# EasyEDA Pro project ProProject_Microplate-Reader-V1.0_2024-02-11.epro

# Schematic Schematic1
Create Date: 2024-02-05; Page Name: P1; Project Name: Microplate-Reader-V1.0; Schematic Name: Schematic2; Update Date: 2024-02-06; Company: EasyEDA.com; Drawn: EasyEDA; Page Size: A4; Part Number: JLCPCB-002; Reviewed: EasyEDA; Version: V0.1
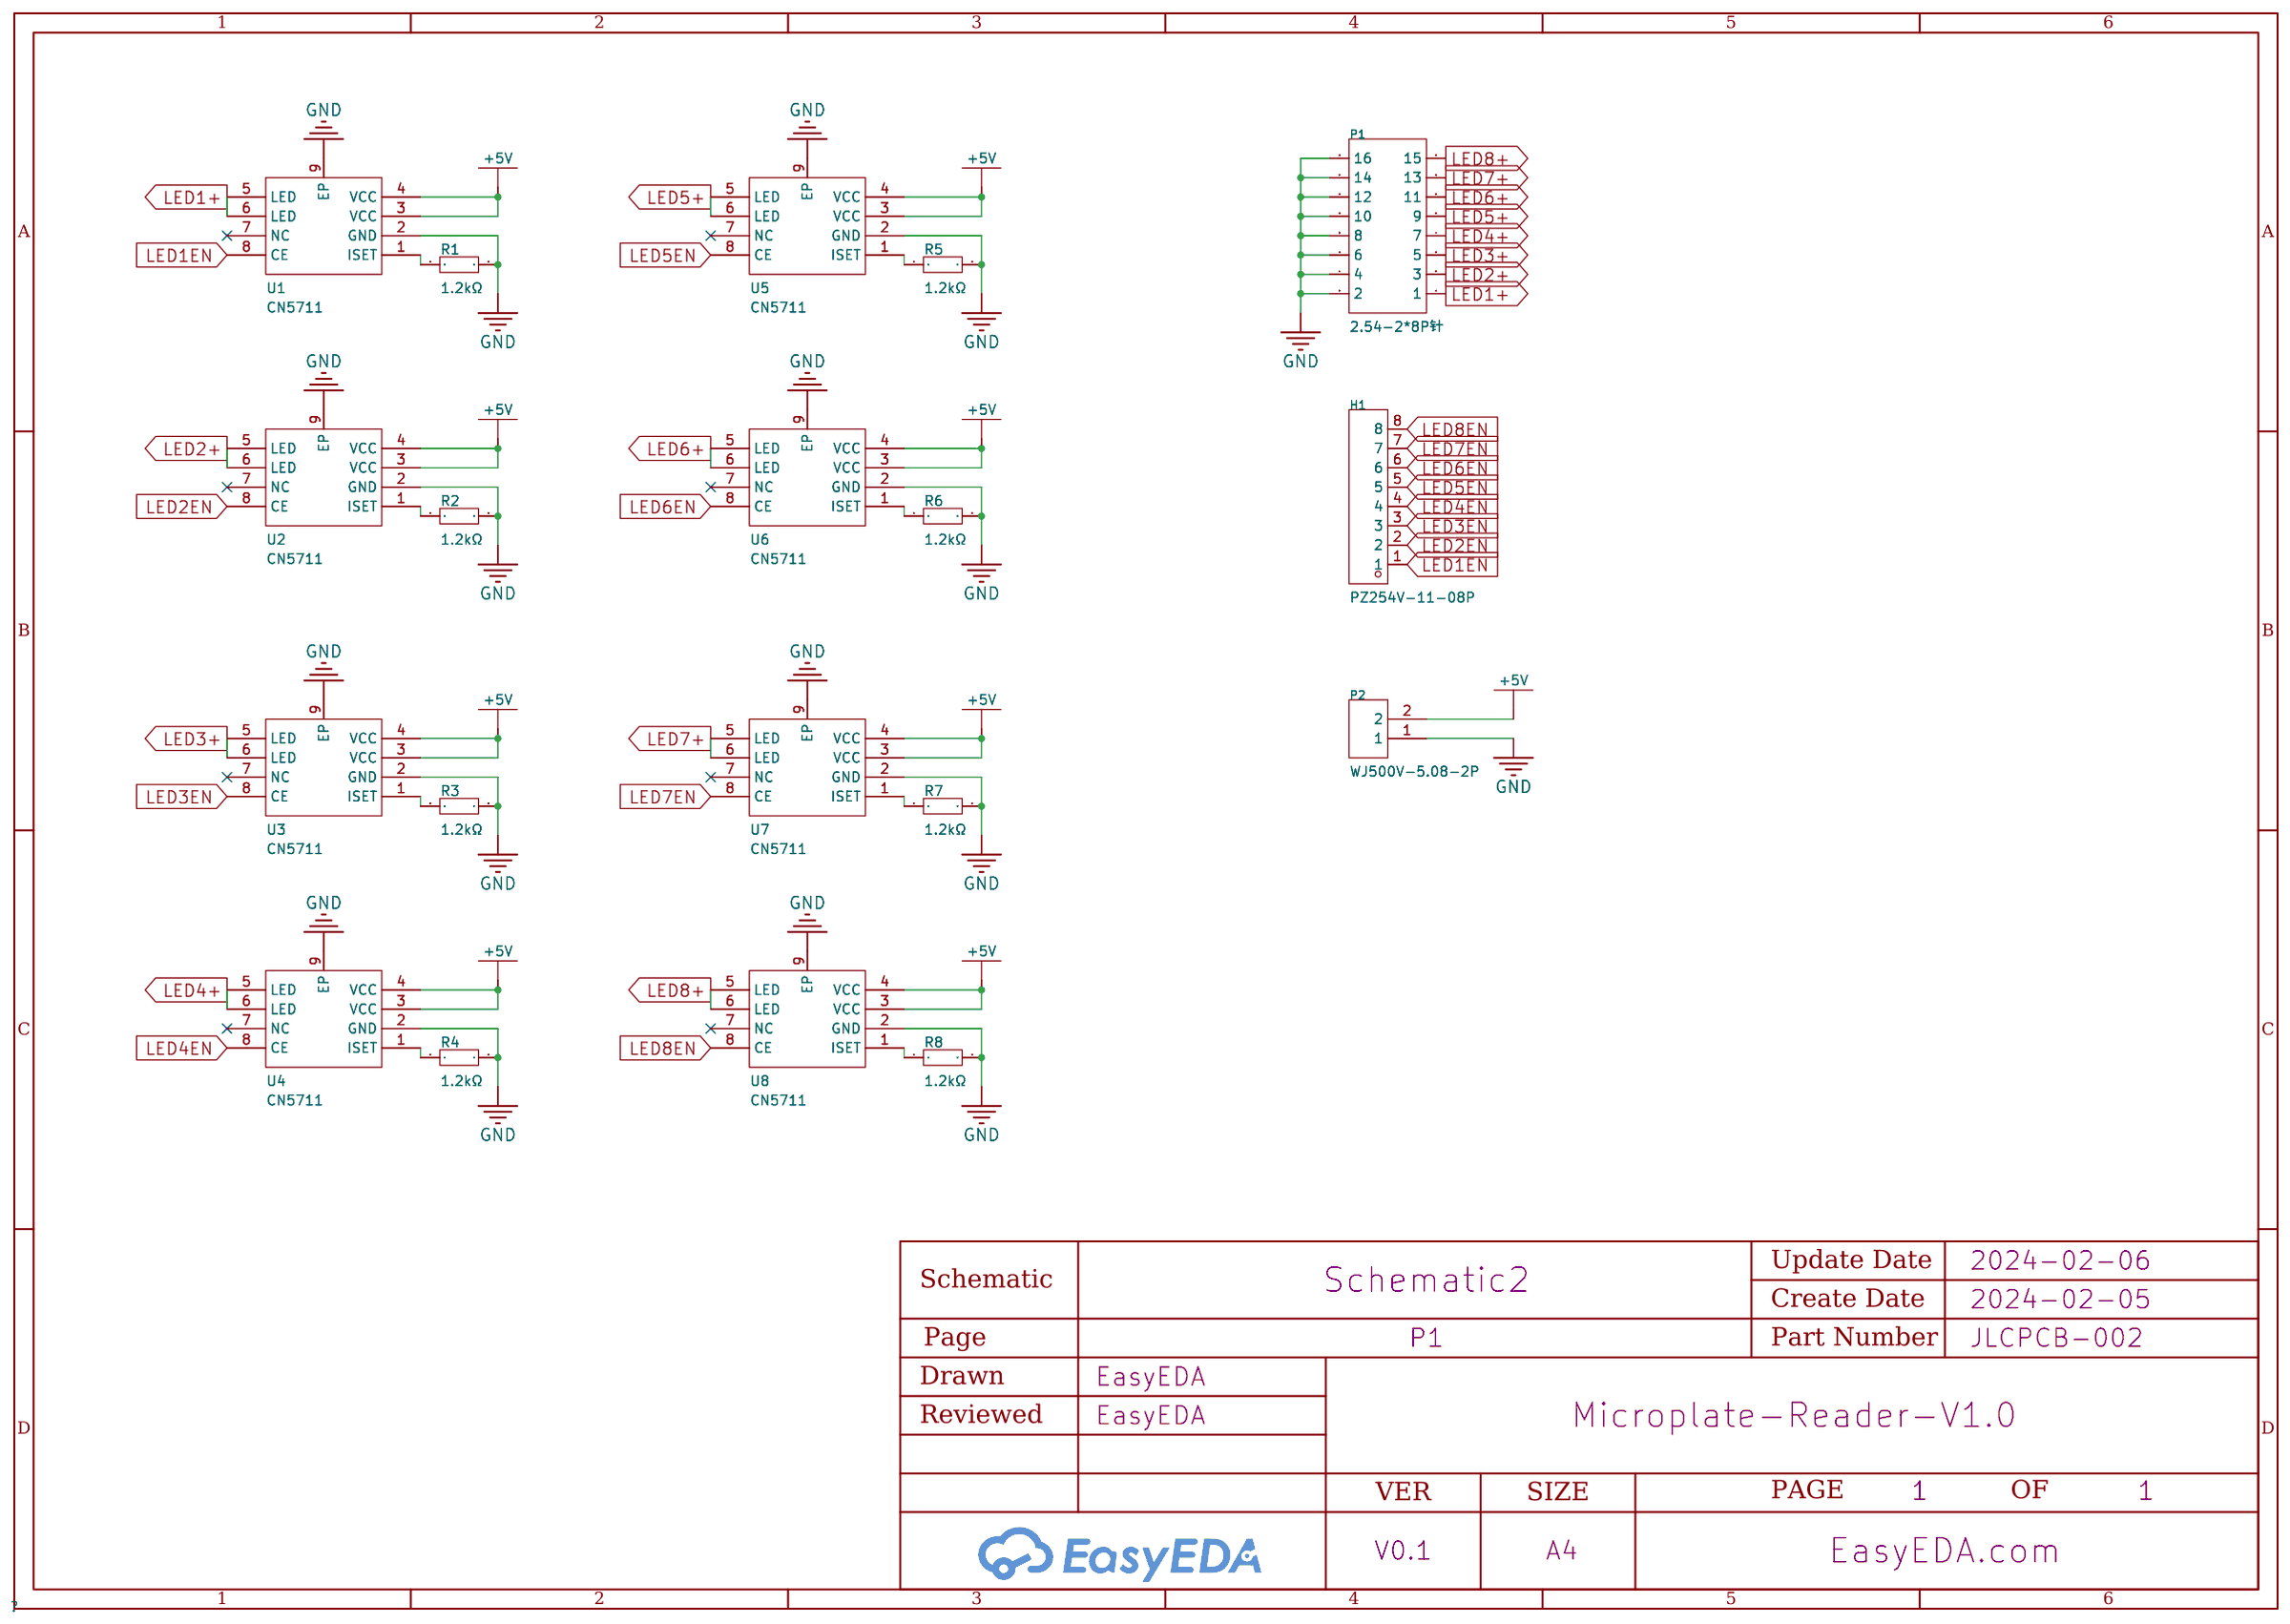
[diagram p0: schematic sheet]

## Parts
H1  PZ254V-11-08P  [HDR-TH_8P-P2.54-V-M]
P1  2.54-2*8P针  [HDR-TH_16P-P2.54-V-M-R2-C8-S2.54]
P2  WJ500V-5.08-2P  [CONN-TH_2P-P5.00_WJ500V-5.08-2P]
R1  1.2kΩ  [R0603]
R2  1.2kΩ  [R0603]
R3  1.2kΩ  [R0603]
R4  1.2kΩ  [R0603]
R5  1.2kΩ  [R0603]
R6  1.2kΩ  [R0603]
R7  1.2kΩ  [R0603]
R8  1.2kΩ  [R0603]
U1  CN5711  [SOIC-8_L5.0-W4.0-P1.27-LS6.0-BL-EP2.0]
U2  CN5711  [SOIC-8_L5.0-W4.0-P1.27-LS6.0-BL-EP2.0]
U3  CN5711  [SOIC-8_L5.0-W4.0-P1.27-LS6.0-BL-EP2.0]
U4  CN5711  [SOIC-8_L5.0-W4.0-P1.27-LS6.0-BL-EP2.0]
U5  CN5711  [SOIC-8_L5.0-W4.0-P1.27-LS6.0-BL-EP2.0]
U6  CN5711  [SOIC-8_L5.0-W4.0-P1.27-LS6.0-BL-EP2.0]
U7  CN5711  [SOIC-8_L5.0-W4.0-P1.27-LS6.0-BL-EP2.0]
U8  CN5711  [SOIC-8_L5.0-W4.0-P1.27-LS6.0-BL-EP2.0]

## Library data of the parts
H1 = PZ254V-11-08P: Pin Structure:1x8P Pitch:2.54mm Row Spacing:- Circluar Pins/Square Pins:Square Pins Mounting Type:Straight Number of Rows:Plugin Number of Pins:8P Current Rating (Max):- Voltage Rating (Max):- Length of Mating Pin:6mm Insulation Height:2.5mm Length of End; LCSC Part Name: 间距:2.54mm 1x8P 直插 方针; Supplier Part: C492407; Manufacturer: XFCN(兴飞); Supplier Footprint: 插件,P=2.54mm; JLCPCB Part Class: 扩展库; Datasheet: https://atta.szlcsc.com/upload/public/pdf/source/20200309/C492407_83A6FB26A2233368EDB9516968EC6149.pdf; Supplier: LCSC; Pin Structure: 1x8P; Pitch: 2.54mm; Circluar Pins/Square Pins: Square Pins; Mounting Type: Straight; Number of Rows: Plugin; Number of Pins: 8P; Length of Mating Pin: 6mm; Insulation Height: 2.5mm; Length of End Connection Pin: 3mm; Operating Temperature Range: -40℃~+105℃; Color: Black
P1 = 2.54-2*8P针_C68234: Pin Structure:2x8P Pitch:2.54mm Row Spacing:2.54mm Circluar Pins/Square Pins:Square Pins Mounting Type:Straight Number of Rows:双排 Number of Pins:16P Current Rating (Max):- Voltage Rating (Max):- Length of Mating Pin:5.9mm Insulation Height:2.54mm Length o; LCSC Part Name: 间距:2.54mm 2x8P 直插 方针; Supplier Part: C68234; Manufacturer: BOOMELE(博穆精密); Supplier Footprint: 插件,P=2.54mm; JLCPCB Part Class: 扩展库; Datasheet: https://atta.szlcsc.com/upload/public/pdf/source/20221201/C605E3BE9C0F7226363017EFD1BDE852.pdf; Supplier: LCSC; Pin Structure: 2x8P; Pitch: 2.54mm; Row Spacing: 2.54mm; Circluar Pins/Square Pins: Square Pins; Mounting Type: Straight; Number of Rows: 双排; Number of Pins: 16P; Length of Mating Pin: 5.9mm; Insulation Height: 2.54mm; Color: Black
P2 = WJ500V-5.08-2P: Structure:1x2P Pitch:5.08mm Color:Green Mounting Style:Straight Current Rating (Max):18A Voltage Rating (Max):250V Number of Pins:2P Number of Rows:1 Wire Gauge - AWG:14~30 Wire Gauge - AWG:14~30 Wire Gauge - mm2:2.5 Wire Gauge - mm2:2.5 Number of PINs Pe; LCSC Part Name: 5.08mm 1x2P 排数:1 每排P数:2 直插; Supplier Part: C8465; Manufacturer: KANGNEX(康奈克斯电气); Supplier Footprint: 插件,P=5.08mm; JLCPCB Part Class: 扩展库; Datasheet: https://atta.szlcsc.com/upload/public/pdf/source/20191225/C8465_02D34CE5B5B4A53DF5891601D97FA9F4.pdf; Supplier: LCSC; Structure: 1x2P; Pitch: 5.08mm; Color: Green; Mounting Style: Straight; Current Rating (Max): 18A; Voltage Rating (Max): 250V; Number of Pins: 2P; Number of Rows: 1; Wire Gauge - AWG: 14~30; Wire Gauge - mm2: 2.5; Number of PINs Per Row: 2; Operating Temperature Range: -40℃~+105℃
R1-R8 = CR0603J1K20P05Z: Type:Thick Film Resistors Resistance: Tolerance:±5% Tolerance:±5% Power(Watts): Temperature Coefficient:±100ppm/℃ Temperature Coefficient:±100ppm/℃ Operating Temperature Range:-55℃~+155℃ Operating Temperature Range:-55℃~+155℃; LCSC Part Name: 1.2kΩ ±5% 100mW; Supplier Part: C881052; Manufacturer: EVER OHMS(天二科技); Supplier Footprint: 0603; JLCPCB Part Class: Extended Part; Datasheet: https://atta.szlcsc.com/upload/public/pdf/source/20201014/C881429_ABC29D63C8D6A11EB63D87348B25AA7B.pdf; Supplier: LCSC; Type: Thick Film Resistors; Tolerance: ±5%; Temperature Coefficient: ±100ppm/℃; Operating Temperature Range: -55℃~+155℃
U1-U8 = CN5711: Type:- Input Voltage:2.8V~6V Input Voltage:2.8V~6V Switch Frequency:- Switch Frequency:- Channels:- Output Voltage:- Output Voltage:- Dimming:- Features:- Topology:- Operating temperature:- Operating temperature:-; Supplier Part: C35634; Manufacturer: CONSONANCE(上海如韵); Supplier Footprint: SOIC-8-EP; JLCPCB Part Class: 扩展库; Datasheet: https://atta.szlcsc.com/upload/public/pdf/source/20151111/1457707576158.pdf; Supplier: LCSC; Input Voltage: 2.8V~6V

## Nets
+5V: P2.2 U1.3(VCC) U1.4(VCC) U2.3(VCC) U2.4(VCC) U3.3(VCC) U3.4(VCC) U4.3(VCC) U4.4(VCC) U5.3(VCC) U5.4(VCC) U6.3(VCC) U6.4(VCC) U7.3(VCC) U7.4(VCC) U8.3(VCC) U8.4(VCC)
GND: P1.2 P1.4 P1.6 P1.8 P1.10 P1.12 P1.14 P1.16 P2.1 R1.2 R2.2 R3.2 R4.2 R5.2 R6.2 R7.2 R8.2 U1.2(GND) U1.9(EP) U2.2(GND) U2.9(EP) U3.2(GND) U3.9(EP) U4.2(GND) U4.9(EP) U5.2(GND) U5.9(EP) U6.2(GND) U6.9(EP) U7.2(GND) U7.9(EP) U8.2(GND) U8.9(EP)
LED1+: P1.1 U1.5(LED) U1.6(LED)
LED1EN: H1.1 U1.8(CE)
LED2+: P1.3 U2.5(LED) U2.6(LED)
LED2EN: H1.2 U2.8(CE)
LED3+: P1.5 U3.5(LED) U3.6(LED)
LED3EN: H1.3 U3.8(CE)
LED4+: P1.7 U4.5(LED) U4.6(LED)
LED4EN: H1.4 U4.8(CE)
LED5+: P1.9 U5.5(LED) U5.6(LED)
LED5EN: H1.5 U5.8(CE)
LED6+: P1.11 U6.5(LED) U6.6(LED)
LED6EN: H1.6 U6.8(CE)
LED7+: P1.13 U7.5(LED) U7.6(LED)
LED7EN: H1.7 U7.8(CE)
LED8+: P1.15 U8.5(LED) U8.6(LED)
LED8EN: H1.8 U8.8(CE)
$1N268: R1.1 U1.1(ISET)
$1N528: R2.1 U2.1(ISET)
$1N805: R3.1 U3.1(ISET)
$1N821: R4.1 U4.1(ISET)
$1N1359: R5.1 U5.1(ISET)
$1N1375: R6.1 U6.1(ISET)
$1N1391: R7.1 U7.1(ISET)
$1N1407: R8.1 U8.1(ISET)

Not connected (* = marked no-connect by the designer): U1 7(NC)*; U2 7(NC)*; U3 7(NC)*; U4 7(NC)*; U5 7(NC)*; U6 7(NC)*; U7 7(NC)*; U8 7(NC)*

# Board PCB1
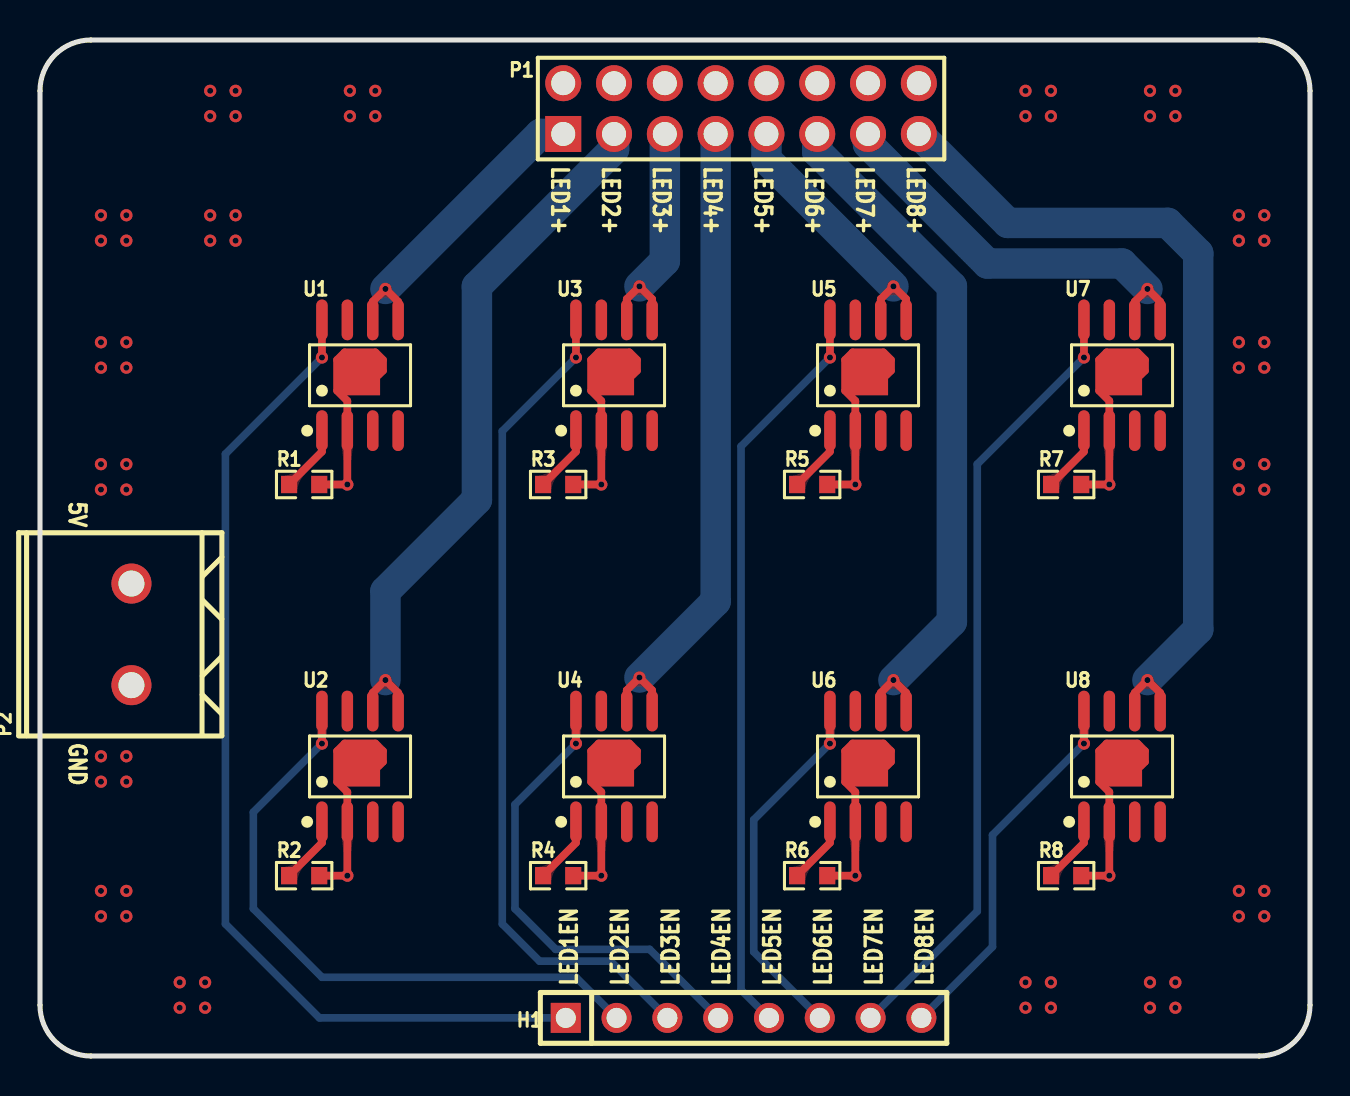
[diagram p1: board, top side]
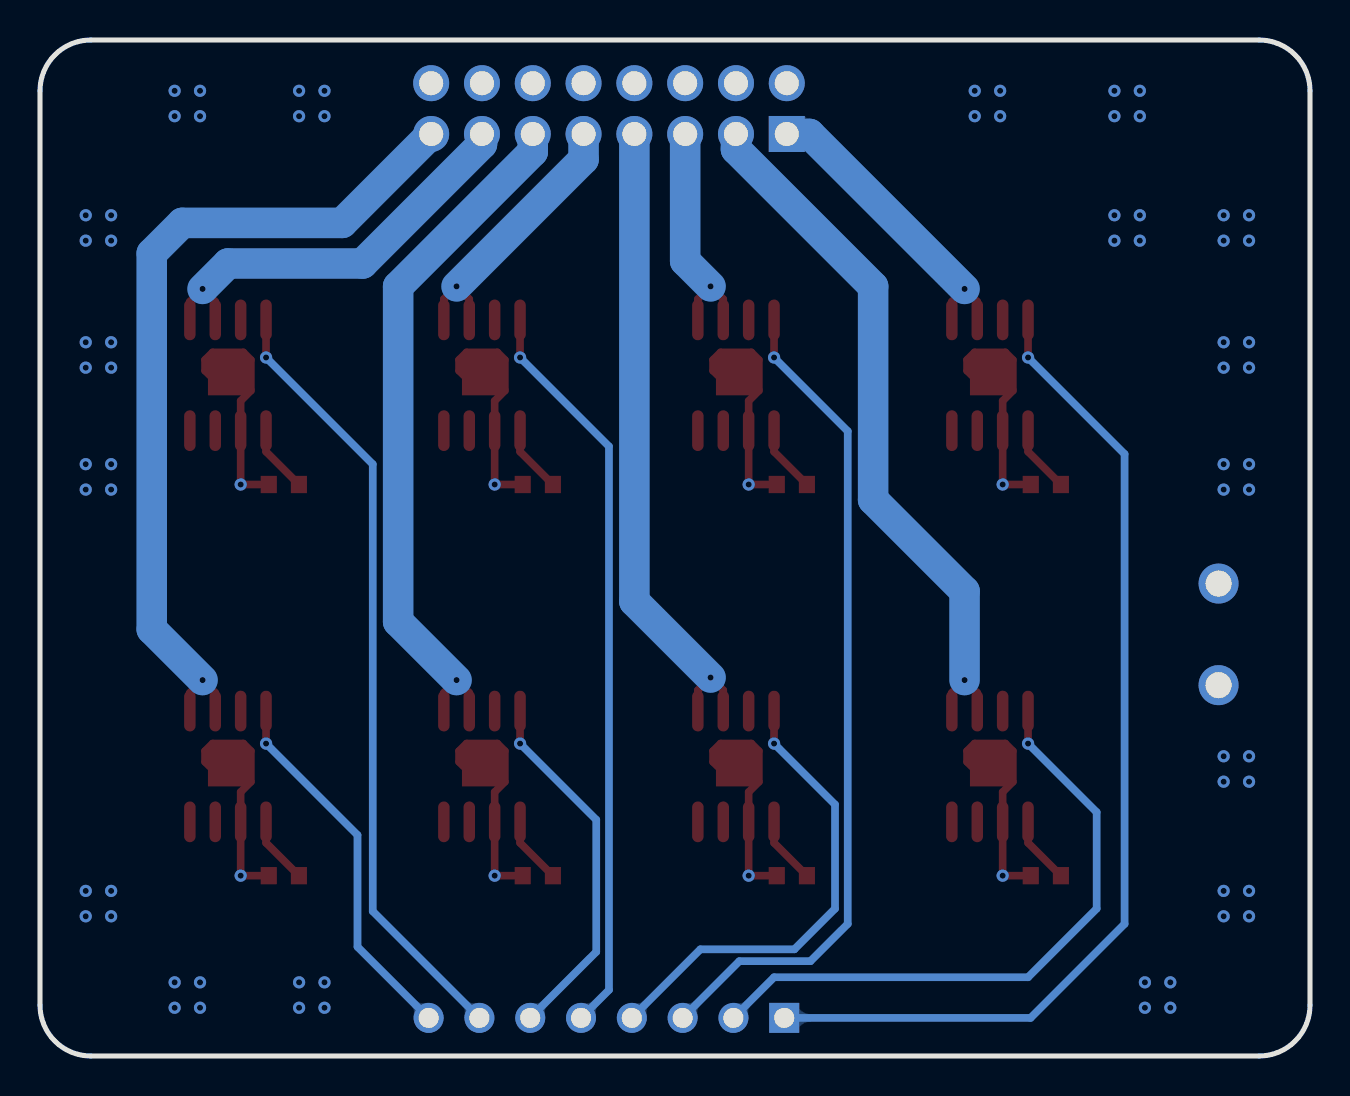
[diagram p2: board, bottom side, seen from below]

Outline 63.5 x 50.8 mm; copper layers: Top Layer, Bottom Layer. Coordinates in mm from the lower left corner of the outline.
Outline path: 0,48.26 0,2.54 arc(0.74,0.74) 2.54,0 60.96,0 arc(62.76,0.74) 63.5,2.54 63.5,48.26 arc(62.76,50.06) 60.96,50.8 2.54,50.8 arc(0.74,50.06) 0,48.26
Stack: Top Layer 0.035mm / Dielectric1 1.51mm FR4 er 4.5 / Bottom Layer 0.035mm

## Design rules (mm)
template: 自定义配置
spacing copperThickness1oz (default): track to track 0.102, other pairs 0.152 to 0.3
spacing copperThickness2oz: track to track 0.203, other pairs 0.152 to 0.3
track width copperThickness1oz (default): min 0.127, default 0.254, max 2.54
track width copperThickness2oz: min 0.203, default 0.254, max 2.54
differential pair differentialPair (default): width min 0.127, default 0.254, max 2.54; gap min 0.152, default 0.152
via viaSize (default): diameter min 0.5, default 0.61, max 10; hole min 0.3, default 0.305, max 6.299

## Placement (name value [footprint] x y rotation side)
H1  PZ254V-11-08P  [HDR-TH_8P-P2.54-V-M]  35.18 1.91 0 top
P1  2.54-2*8P针  [HDR-TH_16P-P2.54-V-M-R2-C8-S2.54]  35.05 47.37 0 top
P2  WJ500V-5.08-2P  [CONN-TH_2P-P5.00_WJ500V-5.08-2P]  4.57 21.08 90 top
R1  1.2kΩ  [R0603]  13.21 28.58 0 top
R2  1.2kΩ  [R0603]  13.21 9.02 0 top
R3  1.2kΩ  [R0603]  25.91 28.58 0 top
R4  1.2kΩ  [R0603]  25.91 9.02 0 top
R5  1.2kΩ  [R0603]  38.61 28.58 0 top
R6  1.2kΩ  [R0603]  38.61 9.02 0 top
R7  1.2kΩ  [R0603]  51.31 28.58 0 top
R8  1.2kΩ  [R0603]  51.31 9.02 0 top
U1  CN5711  [SOIC-8_L5.0-W4.0-P1.27-LS6.0-BL-EP2.0]  16 34.04 0 top
U2  CN5711  [SOIC-8_L5.0-W4.0-P1.27-LS6.0-BL-EP2.0]  16 14.48 0 top
U3  CN5711  [SOIC-8_L5.0-W4.0-P1.27-LS6.0-BL-EP2.0]  28.7 34.04 0 top
U4  CN5711  [SOIC-8_L5.0-W4.0-P1.27-LS6.0-BL-EP2.0]  28.7 14.48 0 top
U5  CN5711  [SOIC-8_L5.0-W4.0-P1.27-LS6.0-BL-EP2.0]  41.4 34.04 0 top
U6  CN5711  [SOIC-8_L5.0-W4.0-P1.27-LS6.0-BL-EP2.0]  41.4 14.48 0 top
U7  CN5711  [SOIC-8_L5.0-W4.0-P1.27-LS6.0-BL-EP2.0]  54.1 34.04 0 top
U8  CN5711  [SOIC-8_L5.0-W4.0-P1.27-LS6.0-BL-EP2.0]  54.1 14.48 0 top

## Footprints (pads in the part's own frame, mm; a bottom-side part is the same pattern mirrored in y, then rotated)
CONN-TH_2P-P5.00_WJ500V-5.08-2P
  round 2 hole 1.3: 1(-2.54,0) 2(2.54,0)
HDR-TH_8P-P2.54-V-M
  rect 1.5x1.5 hole 1: 1(-8.89,0)
  round 1.5 hole 1: 2(-6.35,0) 3(-3.81,0) 4(-1.27,0) 5(1.27,0) 6(3.81,0) 7(6.35,0) 8(8.89,0)
HDR-TH_16P-P2.54-V-M-R2-C8-S2.54
  rect 1.8x1.8 hole 1.2: 1(-8.89,-1.27)
  round 1.8 hole 1.2: 2(-8.89,1.27) 3(-6.35,-1.27) 4(-6.35,1.27) 5(-3.81,-1.27) 6(-3.81,1.27) 7(-1.27,-1.27) 8(-1.27,1.27) 9(1.27,-1.27) 10(1.27,1.27) 11(3.81,-1.27) 12(3.81,1.27) 13(6.35,-1.27) 14(6.35,1.27) 15(8.89,-1.27) 16(8.89,1.27)
R0603
  rect 0.806x0.864 smd: 1(-0.753,0) 2(0.753,0)
SOIC-8_L5.0-W4.0-P1.27-LS6.0-BL-EP2.0
  oval 0.574x2.038 smd: 1(-1.905,-2.769) 2(-0.635,-2.769) 3(0.635,-2.769) 4(1.905,-2.769) 5(1.905,2.769) 6(0.635,2.769) 7(-0.635,2.769) 8(-1.905,2.769)
  rect 2x2 smd: 9(0,0)

## Nets
As in the schematic.

Pads without a net: U1 7; U2 7; U3 7; U4 7; U5 7; U6 7; U7 7; U8 7

## Via types
v1: diameter 0.61, hole 0.305, Top Layer to Bottom Layer, 92 vias

## Routing (per net, layer and track width the routed paths; a pad name or vN(x,y) marks a point on that pad's centre or on a via; arc(x,y) is an arc through that point)
GND: length 90.6
  Top Layer w0.381: 16.92,34.03 17.15,34.27 17.15,34.8 16.77,35.18 15.23,35.18 14.85,34.8 14.85,33.27 15.37,32.76 U1.2 v1(15.37,28.58) R1.2 ; R4.2 v1(28.07,9.02) U4.2 28.07,13.2 27.55,13.71 27.55,15.25 27.93,15.63 29.47,15.63 29.85,15.25 29.85,14.71 29.62,14.48 ; R2.2 v1(15.37,9.02) U2.2 15.37,13.2 14.85,13.71 14.85,15.25 15.23,15.63 16.77,15.63 17.15,15.25 17.15,14.71 16.92,14.48 ; 42.32,14.48 42.55,14.71 42.55,15.25 42.17,15.63 40.63,15.63 40.25,15.25 40.25,13.71 40.77,13.2 U6.2 v1(40.77,9.02) R6.2 ; R8.2 v1(53.47,9.02) U8.2 53.47,13.2 52.95,13.71 52.95,15.25 53.33,15.63 54.87,15.63 55.25,15.25 55.25,14.71 55.02,14.48 ; 55.02,34.03 55.25,34.27 55.25,34.8 54.87,35.18 53.33,35.18 52.95,34.8 52.95,33.27 53.47,32.76 U7.2 v1(53.47,28.58) R7.2 ; R3.2 v1(28.07,28.58) U3.2 28.07,32.76 27.55,33.27 27.55,34.8 27.93,35.18 29.47,35.18 29.85,34.8 29.85,34.27 29.62,34.03 ; 42.32,34.03 42.55,34.27 42.55,34.8 42.17,35.18 40.63,35.18 40.25,34.8 40.25,33.27 40.77,32.76 U5.2 v1(40.77,28.58) R5.2
  vias: v1(3.05,42.04) v1(3.05,40.77) v1(3.05,35.69) v1(3.05,34.42) v1(3.05,29.59) v1(3.05,28.32) v1(3.05,14.99) v1(3.05,13.72) v1(3.05,8.26) v1(3.05,6.99) v1(4.32,42.04) v1(4.32,40.77) v1(4.32,35.69) v1(4.32,34.42) v1(4.32,29.59) v1(4.32,28.32) v1(4.32,14.99) v1(4.32,13.72) v1(4.32,8.26) v1(4.32,6.99) v1(6.98,3.68) v1(6.98,2.41) v1(8.26,3.68) v1(8.26,2.41) v1(8.51,48.26) v1(8.51,46.99) v1(8.51,42.04) v1(8.51,40.77) v1(9.78,48.26) v1(9.78,46.99) v1(9.78,42.04) v1(9.78,40.77) v1(15.49,48.26) v1(15.49,46.99) v1(16.76,48.26) v1(16.76,46.99) v1(49.28,48.26) v1(49.28,46.99) v1(49.28,3.68) v1(49.28,2.41) v1(50.55,48.26) v1(50.55,46.99) v1(50.55,3.68) v1(50.55,2.41) v1(55.5,48.26) v1(55.5,46.99) v1(55.5,3.68) v1(55.5,2.41) v1(56.77,48.26) v1(56.77,46.99) v1(56.77,3.68) v1(56.77,2.41) v1(59.94,42.04) v1(59.94,40.77) v1(59.94,35.69) v1(59.94,34.42) v1(59.94,29.59) v1(59.94,28.32) v1(59.94,8.26) v1(59.94,6.99) v1(61.21,42.04) v1(61.21,40.77) v1(61.21,35.69) v1(61.21,34.42) v1(61.21,29.59) v1(61.21,28.32) v1(61.21,8.26) v1(61.21,6.99)
LED1+: length 15.7
  Top Layer w0.381: 16.64,36.81 16.64,37.72 v1(17.27,38.35) 17.91,37.72 17.91,36.81
  Bottom Layer w1.524: P1.1 25.02,46.1 v1(17.27,38.35)
LED1EN: length 51.2
  Top Layer w0.381: 14.1,36.81 v1(14.1,34.93)
  Bottom Layer w0.381: v1(14.1,34.93) 9.27,30.1 9.27,6.6 13.97,1.91 H1.1
LED2+: length 35.7
  Top Layer w0.381: U2.6 16.64,18.16 v1(17.27,18.8) 17.91,18.16 U2.5
  Bottom Layer w1.524: P1.3 28.7,45.34 21.84,38.48 21.84,27.81 17.27,23.24 v1(17.27,18.8)
LED2EN: length 31.7
  Top Layer w0.381: v1(14.1,15.62) U2.8
  Bottom Layer w0.381: H1.2 26.8,3.94 14.1,3.94 10.67,7.37 10.67,12.19 v1(14.1,15.62)
LED3+: length 12
  Top Layer w0.381: 30.61,36.81 30.61,37.85 v1(29.97,38.48) 29.34,37.85 29.34,36.81
  Bottom Layer w1.524: v1(29.97,38.48) 31.24,39.75 P1.5
LED3EN: length 41.9
  Top Layer w0.381: 26.8,36.81 v1(26.8,34.93)
  Bottom Layer w0.381: H1.3 28.53,4.74 24.98,4.74 23.11,6.6 23.11,31.24 v1(26.8,34.93)
LED4+: length 32.6
  Top Layer w0.381: U4.5 30.61,18.29 v1(29.97,18.92) 29.34,18.29 U4.6
  Bottom Layer w1.524: P1.7 33.78,22.73 v1(29.97,18.92)
LED4EN: length 23.6
  Top Layer w0.381: v1(26.8,15.62) U4.8
  Bottom Layer w0.381: H1.4 30.48,5.33 25.78,5.33 23.75,7.37 23.75,12.57 v1(26.8,15.62)
LED5+: length 14.1
  Top Layer w0.381: 42.04,36.81 42.04,37.85 v1(42.67,38.48) 43.31,37.85 43.31,36.81
  Bottom Layer w1.524: P1.9 36.32,44.83 v1(42.67,38.48)
LED5EN: length 37.3
  Top Layer w0.381: 39.5,36.81 v1(39.5,34.93)
  Bottom Layer w0.381: v1(39.5,34.93) 35.05,30.48 35.05,3.3 H1.5
LED6+: length 34.9
  Top Layer w0.381: U6.5 43.31,18.16 v1(42.67,18.8) 42.04,18.16 U6.6
  Bottom Layer w1.524: P1.11 38.86,45.21 45.59,38.48 45.59,21.72 v1(42.67,18.8)
LED6EN: length 18.3
  Top Layer w0.381: v1(39.5,15.62) U6.8
  Bottom Layer w0.381: H1.6 35.69,5.21 35.69,11.81 v1(39.5,15.62)
LED7+: length 21.1
  Top Layer w0.381: 54.74,36.81 54.74,37.72 v1(55.37,38.35) 56.01,37.72 56.01,36.81
  Bottom Layer w1.524: v1(55.37,38.35) 54.1,39.62 47.37,39.62 41.4,45.59 P1.13
LED7EN: length 39.3
  Top Layer w0.381: 52.2,36.81 v1(52.2,34.93)
  Bottom Layer w0.381: H1.7 46.86,7.24 46.86,29.59 v1(52.2,34.93)
LED8+: length 42.5
  Top Layer w0.381: U8.5 56.01,18.16 v1(55.37,18.8) 54.74,18.16 U8.6
  Bottom Layer w1.524: 43.94,46.1 48.39,41.66 56.39,41.66 57.91,40.13 57.91,21.34 v1(55.37,18.8)
LED8EN: length 18.7
  Top Layer w0.381: v1(52.2,15.62) U8.8
  Bottom Layer w0.381: v1(52.2,15.62) 47.63,11.05 47.63,5.46 H1.8
$1N268: length 3.4
  Top Layer w0.381: R1.1 14.1,30.22 U1.1
$1N528: length 3.4
  Top Layer w0.381: U2.1 14.1,10.66 R2.1
$1N805: length 3.4
  Top Layer w0.381: U3.1 26.8,30.22 R3.1
$1N821: length 3.4
  Top Layer w0.381: R4.1 26.8,10.66 U4.1
$1N1359: length 3.4
  Top Layer w0.381: R5.1 39.5,30.22 U5.1
$1N1375: length 3.4
  Top Layer w0.381: R6.1 39.5,10.66 U6.1
$1N1391: length 3.4
  Top Layer w0.381: R7.1 52.2,30.22 U7.1
$1N1407: length 3.4
  Top Layer w0.381: U8.1 52.2,10.66 R8.1

## Copper pours and planes (outline as drawn; the poured copper is in the pictures)
+5V on Top Layer: 16.13,12.57 16.38,12.83 18.42,12.83 19.18,13.59 19.18,21.08 22.23,21.08 22.23,11.3 21.59,10.67 16.38,10.67 16.13,10.92
+5V on Top Layer: 16.26,32.39 18.29,32.39 18.29,26.16 16.26,26.16
+5V on Top Layer: 28.96,32.39 30.99,32.39 30.99,26.16 28.96,26.16
+5V on Top Layer: 41.66,32.39 43.69,32.39 43.69,26.16 41.66,26.16
+5V on Top Layer: 54.36,32.39 56.39,32.39 56.39,26.16 54.36,26.16
+5V on Top Layer: 54.36,12.51 54.61,12.76 56.64,12.76 57.02,13.14 57.02,21.02 58.67,21.02 58.67,10.6 54.61,10.6 54.36,10.86
+5V on Top Layer: 28.96,12.57 29.21,12.83 31.24,12.83 32,13.59 32,21.08 35.05,21.08 35.05,11.3 34.42,10.67 29.21,10.67 28.96,10.92
+5V on Top Layer: 2.54,24.51 4.57,26.54 58.67,26.54 59.82,25.4 59.82,21.72 58.67,20.57 4.57,20.57 2.54,22.61
+5V on Top Layer: 41.66,12.57 41.91,12.83 43.94,12.83 44.7,13.59 44.7,21.08 47.75,21.08 47.75,11.3 47.12,10.67 41.91,10.67 41.66,10.92
GND on Top Layer: -0.76,51.31 68.58,51.31 68.58,-1.02 -0.76,-1.02
GND on Bottom Layer: -5.97,54.74 65.02,54.74 65.02,-2.29 -5.97,-2.29

Small or netless copper shapes (teardrops, artwork), in the pictures only: 110 on Top Layer, 18 on Bottom Layer

## Text on the board
Top Silkscreen Layer: 5V | GND | LED1EN | LED2EN | LED3EN | LED4EN | LED5EN | LED6EN | LED7EN | LED8EN | LED1+ | LED2+ | LED3+ | LED4+ | LED5+ | LED6+ | LED7+ | LED8+
